# Altium project Smart_Door_Lock.PrjPcb
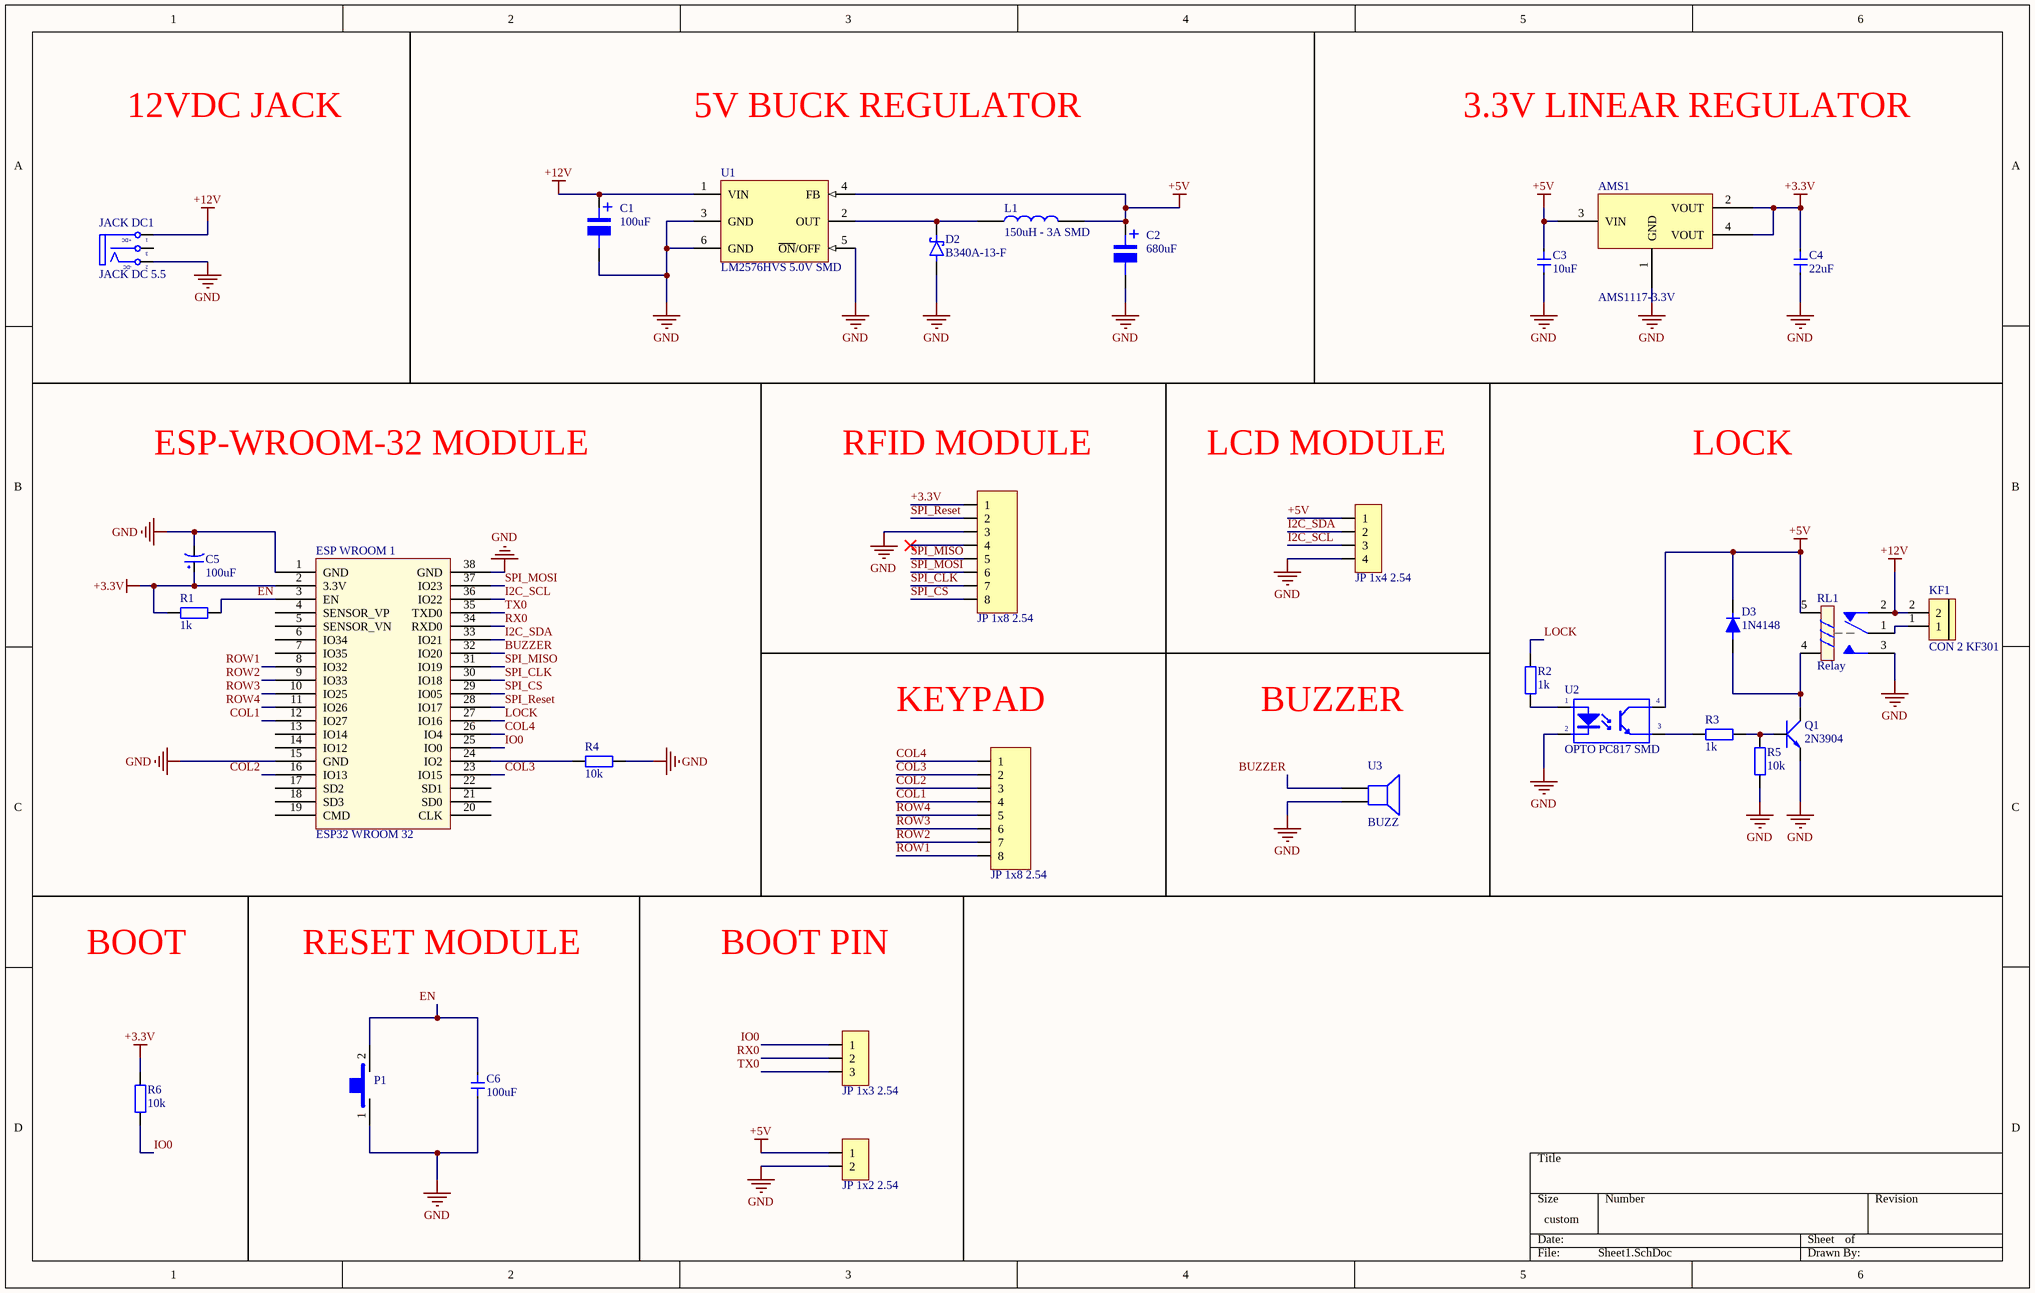
[diagram p0: Sheet1.SchDoc]
1 sheet, 30 parts. Net scope: global (net labels, ports and power ports of the same name join across sheets).
Board file: PCB1.PcbDoc

## Sheet Sheet1.SchDoc
size 381 x 241 mm; SheetNumber: 1; SheetTotal: 1

### Parts
AMS1  AMS1117-3.3V  [SOT223]
C1  100uF  [tu nhom 6.3 (d)]
C2  680uF  [tu nhom 10 (G)]
C3  10uF  [Cap 0603]
C4  22uF  [Cap 0603]
C5  100uF  [tu tantalum smd3528]
C6  100uF  [Cap 0603]
D2  B340A-13-F  [DIOM5226X240N]
D3  1N4148  [SOD-323]
ESP_WROOM_1  ESP32 WROOM 32  [ESP32-WROOM-32D]
JACK_DC1  JACK DC 5.5  [JACK DC 5.5]
JP1  JP 1x8 2.54  [JP 1x8 CT]
JP2  JP 1x4 2.54  [JP 1x4 CC]
JP3  JP 1x8 2.54  [JP 1x8 CT]
JP4  JP 1x3 2.54  [JP 1x3 DT]
JP5  JP 1x2 2.54  [JP 1x2 DT]
KF1  CON 2 KF301  [Con 2 KF301 5.08]
L1  150uH - 3A SMD  [Cuon Cam 12x12x10]
P1  (no value)  [SW 2P SMD]
Q1  2N3904  [TO92]
R1  1k  [tro smd 0603]
R2  1k  [tro smd 0603]
R3  1k  [tro smd 0603]
R4  10k  [tro smd 0603]
R5  10k  [tro smd 0603]
R6  10k  [tro smd 0603]
RL1  Relay  [Relay 5 Chan SRD]
U1  LM2576HVS 5.0V SMD  [TO263-5]
U2  OPTO PC817 SMD  [SOP4]
U3  BUZZ  [BUZZER_D9_TH]

### Nets
+3.3V: AMS1.2(VOUT) AMS1.4(VOUT) C4.1 C5.1 ESP_WROOM_1.2(3.3V) JP1.1 R1.2 R6.1
+5V: AMS1.3(VIN) C2.1 C3.1 D3.2(CATHODE) JP2.1 JP5.1 L1.2 RL1.5 U1.4(FB) U2.4(C)
+12V: C1.1 JACK_DC1.1(T) KF1.2 RL1.2 U1.1(VIN)
GND: AMS1.1(GND) C1.2 C2.2 C3.2 C4.2 C5.2 C6.2 D2.A ESP_WROOM_1.1(GND) ESP_WROOM_1.15(GND) ESP_WROOM_1.38(GND) JACK_DC1.2(TN) JP1.3 JP2.4 JP5.2 P1.1 Q1.1(E) R4.1 R5.1 RL1.3 U1.3(GND) U1.5(~{ON}/OFF) U1.6(GND) U2.2(K) U3.2
BUZZER: ESP_WROOM_1.32(IO20) U3.1
COL1: ESP_WROOM_1.12(IO27) JP3.4
COL2: ESP_WROOM_1.16(IO13) JP3.3
COL3: ESP_WROOM_1.23(IO15) JP3.2
COL4: ESP_WROOM_1.26(IO4) JP3.1
EN: C6.1 ESP_WROOM_1.3(EN) P1.2 R1.1
I2C_SCL: ESP_WROOM_1.36(IO22) JP2.3
I2C_SDA: ESP_WROOM_1.33(IO21) JP2.2
IO0: ESP_WROOM_1.25(IO0) JP4.1 R6.2
LOCK: ESP_WROOM_1.27(IO16) R2.1
ROW1: ESP_WROOM_1.8(IO32) JP3.8
ROW2: ESP_WROOM_1.9(IO33) JP3.7
ROW3: ESP_WROOM_1.10(IO25) JP3.6
ROW4: ESP_WROOM_1.11(IO26) JP3.5
RX0: ESP_WROOM_1.34(RXD0) JP4.2
SPI_CLK: ESP_WROOM_1.30(IO18) JP1.7
SPI_CS: ESP_WROOM_1.29(IO05) JP1.8
SPI_MISO: ESP_WROOM_1.31(IO19) JP1.5
SPI_MOSI: ESP_WROOM_1.37(IO23) JP1.6
SPI_Reset: ESP_WROOM_1.28(IO17) JP1.2
TX0: ESP_WROOM_1.35(TXD0) JP4.3
NetD2_C: D2.C L1.1 U1.2(OUT)
NetD3_1: D3.1(ANODE) Q1.3(C) RL1.4
NetESP_WROOM_1_24: ESP_WROOM_1.24(IO2) R4.2
NetKF1_1: KF1.1 RL1.1
NetQ1_2: Q1.2(B) R3.2 R5.2
NetR2_2: R2.2 U2.1(A)
NetR3_1: R3.1 U2.3(E)

Not connected (* = marked no-connect by the designer): ESP_WROOM_1 4(SENSOR_VP) 5(SENSOR_VN) 6(IO34) 7(IO35) 13(IO14) 14(IO12) 17(SD2) 18(SD3) 19(CMD) 20(CLK) 21(SD0) 22(SD1); JACK_DC1 3(S); JP1 4*

### Notes on the sheet
- 12VDC JACK
- 5V BUCK REGULATOR
- 3.3V LINEAR REGULATOR
- ESP-WROOM-32 MODULE
- (near JP1) RFID MODULE
- LCD MODULE
- LOCK
- (near JP3) KEYPAD
- BUZZER
- BOOT
- RESET MODULE
- BOOT PIN
- (in symbol JACK DC 5.5) +DC; -DC
- (in symbol Tu Nhom 100uF 25V) +
- (in symbol Tu Nhom 680uF 16V) +

### Library data of the parts
AMS1 = AMS1117 SMD: Dán; Value: AMS1117-3.3V SOT223; Don_Vi: Con; Ma_Hang: MH000596; Ghi_Chu: *; Kieu_Chan: *; Chung_Loai: Dán
C1 = Tu Nhom 100uF 25V: Dán; Don_Vi: Con; So_Chan: 2; Ten_Linh_Kien: Tụ Nhôm 100uF 25V 6x7MM; Ma_Hang: MH002222; Chung_Loai: Dán; Kieu_Chan: *
C2 = Tu Nhom 680uF 16V: Dán; Don_Vi: Con; So_Chan: 2; Ten_Linh_Kien: Tụ Nhôm 680uF 16V 10x10.5MM; Ma_Hang: MH007513; Chung_Loai: Dán; Kieu_Chan: *
C3 C4 C6 = Cap 0603: Capacitor SMD 0603
C5 = Tu tantalum 100uF 6.3V SMD3528: Dán; Don_Vi: Con; So_Chan: 2; Ten_Linh_Kien: Tụ tantalum 107J-100uF 6.3V SMD3528; Ma_Hang: MH007595; Chung_Loai: Dán; Kieu_Chan: *
D2 = B340A-13-F: Diode Schottky 40V 3A Surface Mount SMA; MF: Diodes Inc.; Availability: Unavailable; MP: B340A-13-F; Price: None; Value: *; SnapEDA_Link: https://www.snapeda.com/parts/B340A-13-F/Diodes%20Inc./view-part/78704/?ref=snap; Package: DO-214 Diodes Inc.
D3 = DIODE GEN PURP 75V 150MA DO35
JACK_DC1 = JACK DC 5.5: Value: Jac DC
JP1 JP3 = JP 1x8 2.54 Cai Thang: Cắm; Ten_Linh_Kien: Jump Đơn Cái 2.54MM 1x20P Thẳng; Don_Vi: Con; Ma_Hang: MH004006; Ghi_Chu: *; Kieu_Chan: *; Chung_Loai: Cắm
JP2 = JP 1x4 2.54 Cai Cong: Cắm; Ten_Linh_Kien: Jump Đơn Cái 2.54MM 1x40P Cong; Don_Vi: Con; Ma_Hang: MH001265; Ghi_Chu: *; Kieu_Chan: *; Chung_Loai: Cắm
JP4 = JP 1x3 2.54 Duc Thang: Cắm; Ten_Linh_Kien: Jump Đơn Đực 2.54MM 1x40P Thẳng 11MM; Don_Vi: Con; Ma_Hang: MH000903; Ghi_Chu: *; Kieu_Chan: *; Chung_Loai: Cắm
JP5 = JP 1x2 2.54 Duc Thang: Cắm; Ten_Linh_Kien: Jump Đơn Đực 2.54MM 1x40P Thẳng 11MM; Don_Vi: Con; Ma_Hang: MH000903; Ghi_Chu: *; Kieu_Chan: *; Chung_Loai: Cắm
KF1 = CON 2 KF301: Cắm; Ma_Hang: MH000987; Ten_Linh_Kien: CON 2 KF301-2P 5.08MM Xanh Dương; Chung_Loai: Cắm; Ghi_Chu: *; Kieu_Chan: *; Don_Vi: Con
L1 = CUON CAM 100uH SMD: Dán; Don_Vi: Con; Ma_Hang: MH003999; Ten_Linh_Kien: Cuộn Cảm 100uH 7x7x4MM CD74; Ma_Hang: *; Kieu_Chan: *; Chung_Loai: Dán
P1 = Button 2 SMD: SMD Mini Push Button Switch 2 Pin 3x6x2.7mm; MPN: SMD Mini Push Button 2 SMD; Link: https://ram-e-shop.com/product/press2pin-smd/
Q1 = Trans 2N3904: NPN transistor EBC; Value: C9014
R1-R3 = Tro 0603 1% 1k: Dán; So_Chan: 2; Don_Vi: Con; Ten_Linh_Kien: Trở 0603 1% 1k; Ma_Hang: MH006334; Chung_Loai: Dán; Kieu_Chan: *
R4-R6 = Tro 0603 1% 10k: Dán; Don_Vi: Con; So_Chan: 2; Ten_Linh_Kien: Trở 0603 1% 10k; Ma_Hang: MH006333; Chung_Loai: Dán; Kieu_Chan: *
RL1 = Relay 5 Chan SRD: Relay 5 Chan; Ma_Hang: MH009374; Ten: Relay 5V10A SRD-05VDC-SL-C Chính Hãng
U1 = LM2576HVS 5.0V SMD: Dán; Ten_Linh_Kien: LM2576HVS-5.0V BUCK 5V 3A TO263-5; Don_Vi: Con; Ma_Hang: MH002362; Ghi_Chu: *; Kieu_Chan: *; Chung_Loai: Dán
U2 = OPTO PC817 SMD: Single Opto; Value: PC817
U3 = Speaker: Loudspeaker